# EAGLE design vr09 (EAGLE 9.5.1)
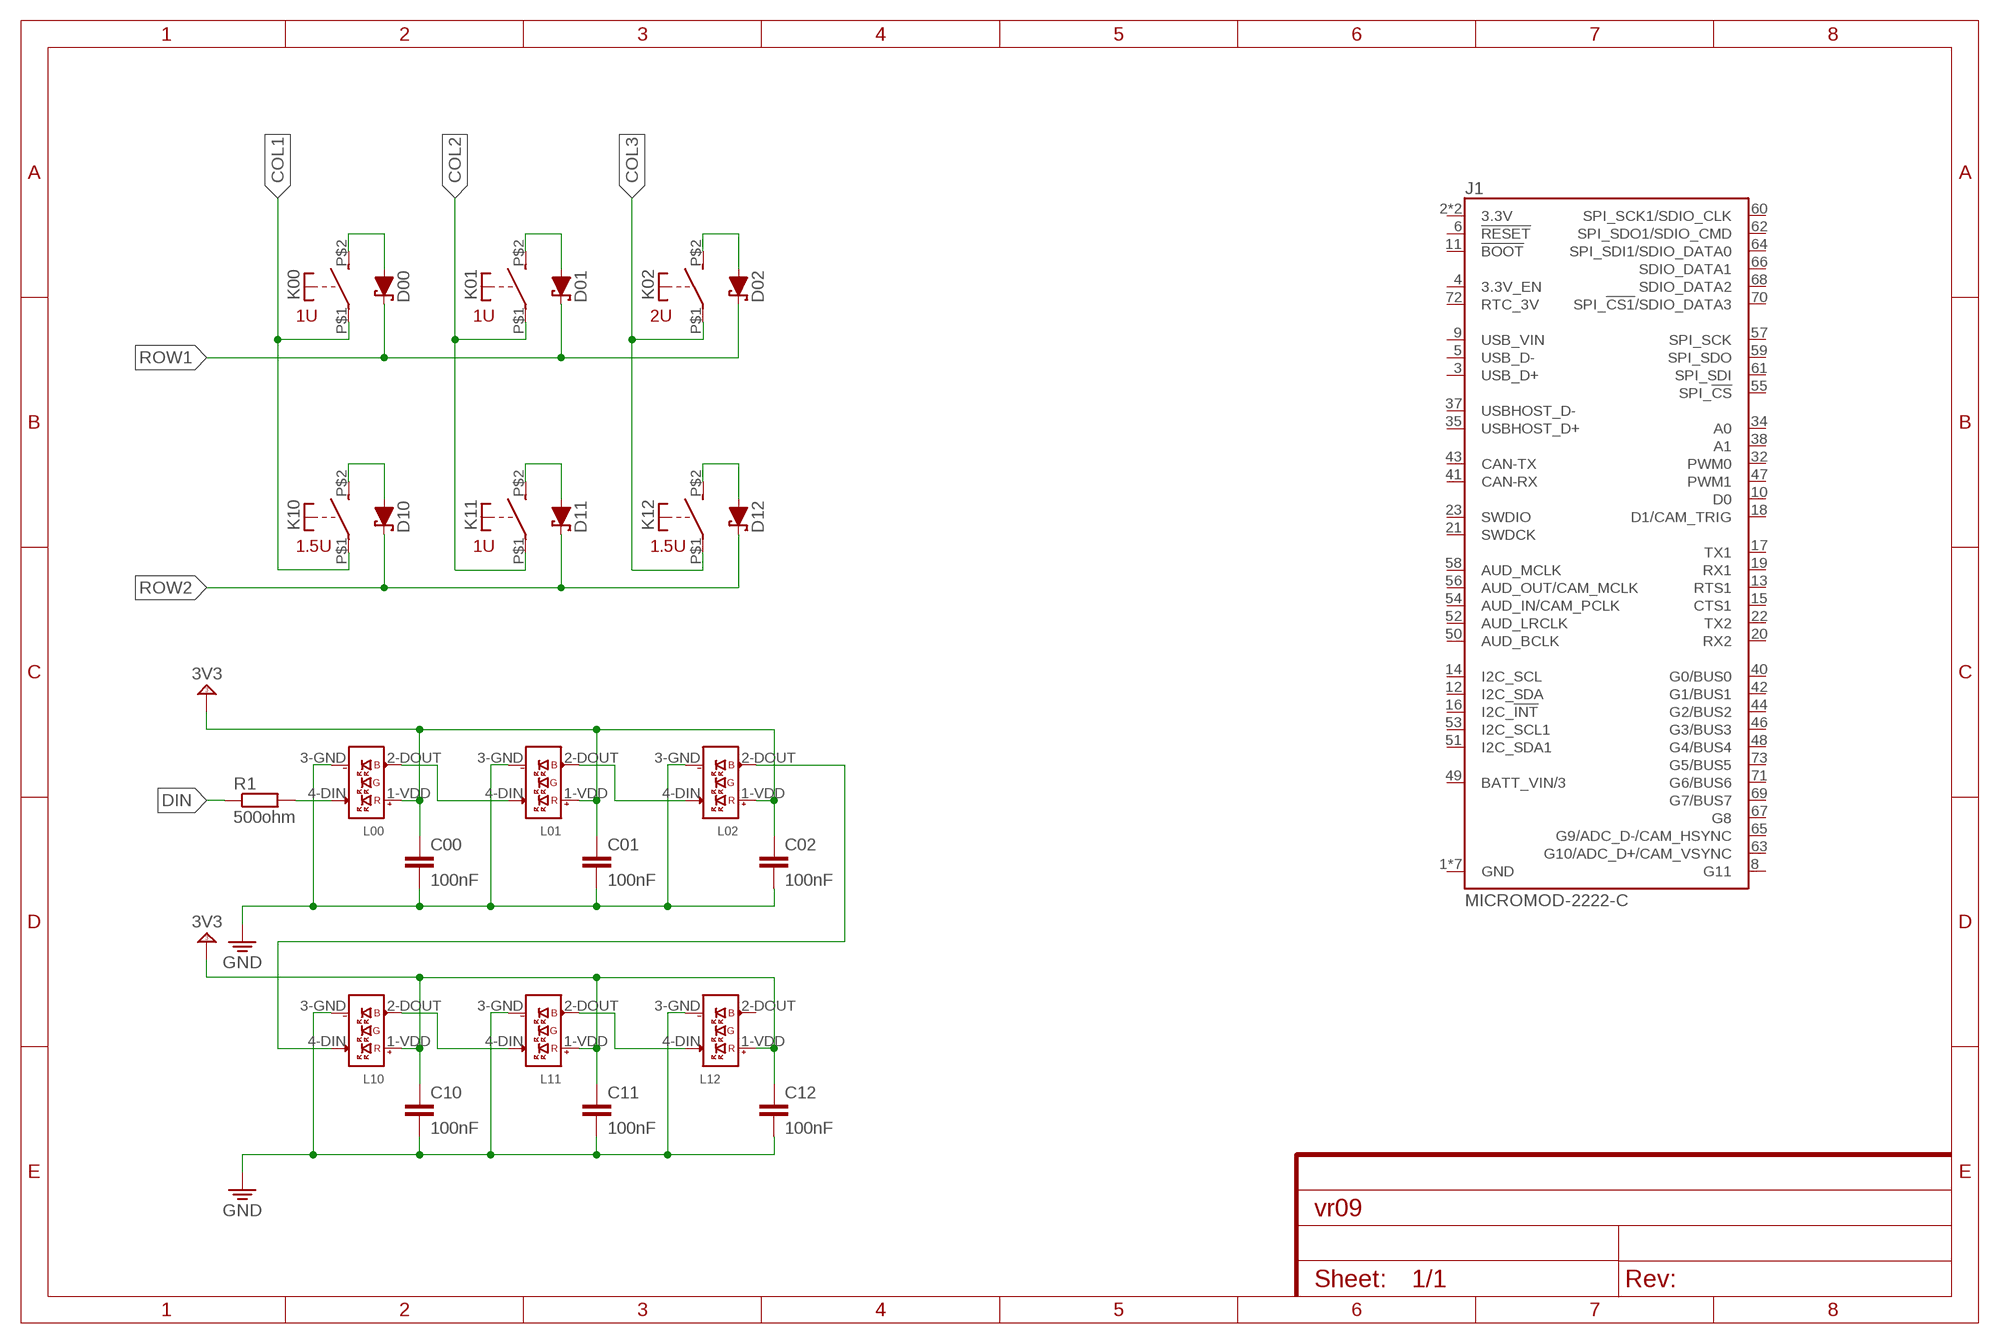
[diagram p0: schematic, sheet 1]

## Parts
C00  100nF  C-EUC0603  [C0603]
C01  100nF  C-EUC0603  [C0603]
C02  100nF  C-EUC0603  [C0603]
C10  100nF  C-EUC0603  [C0603]
C11  100nF  C-EUC0603  [C0603]
C12  100nF  C-EUC0603  [C0603]
D00  1N5819WS  [SOD-123]
D01  1N5819WS  [SOD-123]
D02  1N5819WS  [SOD-123]
D10  1N5819WS  [SOD-123]
D11  1N5819WS  [SOD-123]
D12  1N5819WS  [SOD-123]
J1  MICROMOD-2222-C  [M.2-CONNECTOR-E]
K00  MX-5-PIN-HOTSWAP  [MX-5-PIN-HOTSWAP]
K01  MX-5-PIN-HOTSWAP  [MX-5-PIN-HOTSWAP]
K02  MX-5-PIN-HOTSWAP  [MX-5-PIN-HOTSWAP]
K10  MX-5-PIN-HOTSWAP  [MX-5-PIN-HOTSWAP]
K11  MX-5-PIN-HOTSWAP  [MX-5-PIN-HOTSWAP]
K12  MX-5-PIN-HOTSWAP  [MX-5-PIN-HOTSWAP]
L00  SK6812-E-REVERSEDRILL  [SK6812-E-DRILL]
L01  SK6812-E-REVERSEDRILL  [SK6812-E-DRILL]
L02  SK6812-E-REVERSEDRILL  [SK6812-E-DRILL]
L10  SK6812-E-REVERSEDRILL  [SK6812-E-DRILL]
L11  SK6812-E-REVERSEDRILL  [SK6812-E-DRILL]
L12  SK6812-E-REVERSEDRILL  [SK6812-E-DRILL]
R1  500ohm  R-EU_R0603  [R0603]
U$1  MX-FPRINT-1905-100U  [MX-FPRINT-1905-100U]
U$2  MX-FPRINT-1905-100U  [MX-FPRINT-1905-100U]
U$3  MX-FPRINT-1905-200U  [MX-FPRINT-1905-200U]
U$4  MX-FPRINT-1905-150U  [MX-FPRINT-1905-150U]
U$5  MX-FPRINT-1905-100U  [MX-FPRINT-1905-100U]
U$6  MX-FPRINT-1905-150U  [MX-FPRINT-1905-150U]

## Nets
COL1: K00.P$1(P) K10.P$1(P)
COL2: K01.P$1(P) K11.P$1(P)
COL3: K02.P$1(P) K12.P$1(P)
DIN: R1.1
GND: C00.2 C01.2 C02.2 C10.2 C11.2 C12.2 L00.3-GND(3_GND) L01.3-GND(3_GND) L02.3-GND(3_GND) L10.3-GND(3_GND) L11.3-GND(3_GND) L12.3-GND(3_GND)
N$1: D10.A K10.P$2(S)
N$2: D11.A K11.P$2(S)
N$3: D12.A K12.P$2(S)
N$4: D02.A K02.P$2(S)
N$5: D01.A K01.P$2(S)
N$6: L00.4-DIN(4_DIN) R1.2
N$7: D00.A K00.P$2(S)
N$11: L00.2-DOUT(2_DOUT) L01.4-DIN(4_DIN)
N$12: L01.2-DOUT(2_DOUT) L02.4-DIN(4_DIN)
N$13: L11.2-DOUT(2_DOUT) L12.4-DIN(4_DIN)
N$14: L10.2-DOUT(2_DOUT) L11.4-DIN(4_DIN)
N$19: L02.2-DOUT(2_DOUT) L10.4-DIN(4_DIN)
ROW1: D00.C D01.C D02.C
ROW2: D10.C D11.C D12.C
VCC: C00.1 C01.1 C02.1 C10.1 C11.1 C12.1 L00.1-VDD(1_VDD) L01.1-VDD(1_VDD) L02.1-VDD(1_VDD) L10.1-VDD(1_VDD) L11.1-VDD(1_VDD) L12.1-VDD(1_VDD) ; supply symbol labelled 3V3
Unconnected: J1.1(GND) J1.2(3.3V) J1.3(USB_D+) J1.4(3.3V_EN) J1.5(USB_D-) J1.6(!RESET!) J1.7(GND) J1.8(G11) J1.9(USB_VIN) J1.10(D0) J1.11(!BOOT!) J1.12(I2C_SDA) J1.13(RTS1) J1.14(I2C_SCL) J1.15(CTS1) J1.16(I2C_!INT!) J1.17(TX1) J1.18(D1/CAM_TRIG) J1.19(RX1) J1.20(RX2) J1.21(SWDCK) J1.22(TX2) J1.23(SWDIO) J1.32(PWM0) J1.33(GND) J1.34(A0) J1.35(USBHOST_D+) J1.36(GND) J1.37(USBHOST_D-) J1.38(A1) J1.39(GND) J1.40(G0/BUS0) J1.41(CAN-RX) J1.42(G1/BUS1) J1.43(CAN-TX) J1.44(G2/BUS2) J1.45(GND) J1.46(G3/BUS3) J1.47(PWM1) J1.48(G4/BUS4) J1.49(BATT_VIN/3) J1.50(AUD_BCLK) J1.51(I2C_SDA1) J1.52(AUD_LRCLK) J1.53(I2C_SCL1) J1.54(AUD_IN/CAM_PCLK) J1.55(SPI_!CS!) J1.56(AUD_OUT/CAM_MCLK) J1.57(SPI_SCK) J1.58(AUD_MCLK) J1.59(SPI_SDO) J1.60(SPI_SCK1/SDIO_CLK) J1.61(SPI_SDI) J1.62(SPI_SDO1/SDIO_CMD) J1.63(G10/ADC_D+/CAM_VSYNC) J1.64(SPI_SDI1/SDIO_DATA0) J1.65(G9/ADC_D-/CAM_HSYNC) J1.66(SDIO_DATA1) J1.67(G8) J1.68(SDIO_DATA2) J1.69(G7/BUS7) J1.70(SPI_!CS1!/SDIO_DATA3) J1.71(G6/BUS6) J1.72(RTC_3V) J1.73(G5/BUS5) J1.74(3.3V) J1.75(GND) L12.2-DOUT(2_DOUT)

## Library data of the parts
C00 C01 C02 C10-C12 = rcl:C-EU: CAPACITOR, European symbol; SPICEPREFIX: C
D00 D01 D02 D10-D12 = jlcpcb_basic_parts:1N5819WS: JLCPCB Part # C8598 Description 40V 600mV@1A 1A SOD-123 Schottky Barrier Diodes (SBD) ROHS Schottky Diode
J1 = SparkFun-MicroMod:MICROMOD: MicroMod Connector Description: A card edge connector and mating PCB connector to allow various MicroMod Processor Boards to be coupled with various carrier boards of different capabilities. Based on the M.2 standard.; PROD_ID: CONN-14877
K00 K01 K02 K10-K12 = ts_keyboards:MX-5-PIN-HOTSWAP
L00 L01 L02 L10-L12 = ts_keyboards:SK6812-E-REVERSE
R1 = rcl:R-EU_: RESISTOR, European symbol; SPICEPREFIX: R
U$1 U$2 U$5 = ts_keyboards:MX-FPRINT-1905-100U
U$3 = ts_keyboards:MX-FPRINT-1905-200U
U$4 U$6 = ts_keyboards:MX-FPRINT-1905-150U

## Board
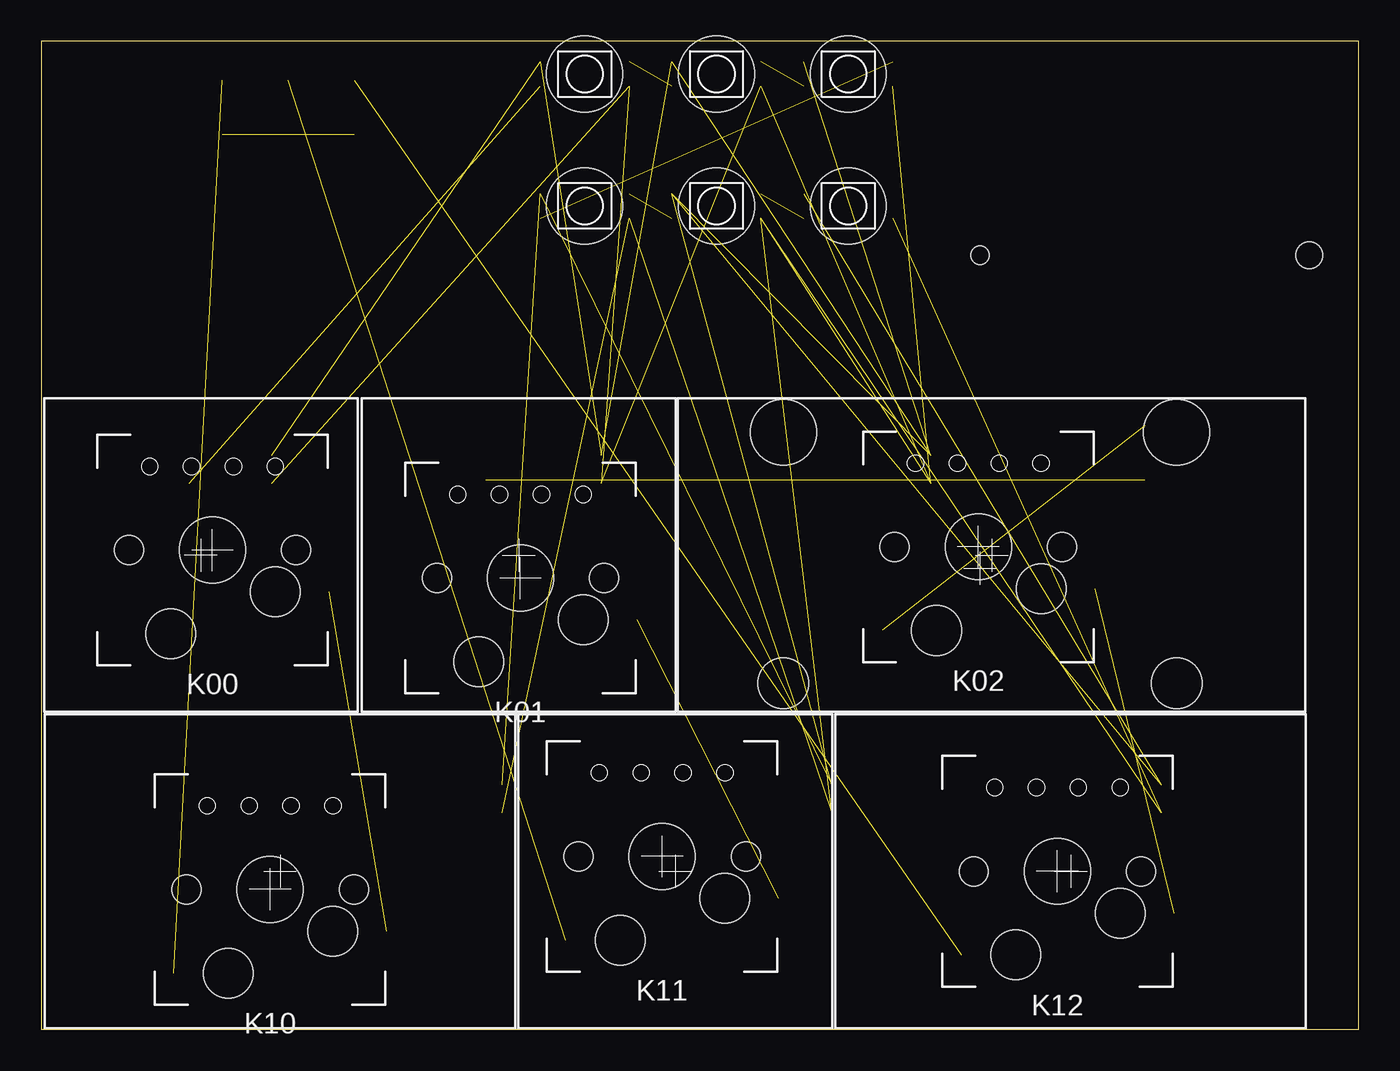
[diagram p1: board, top side]
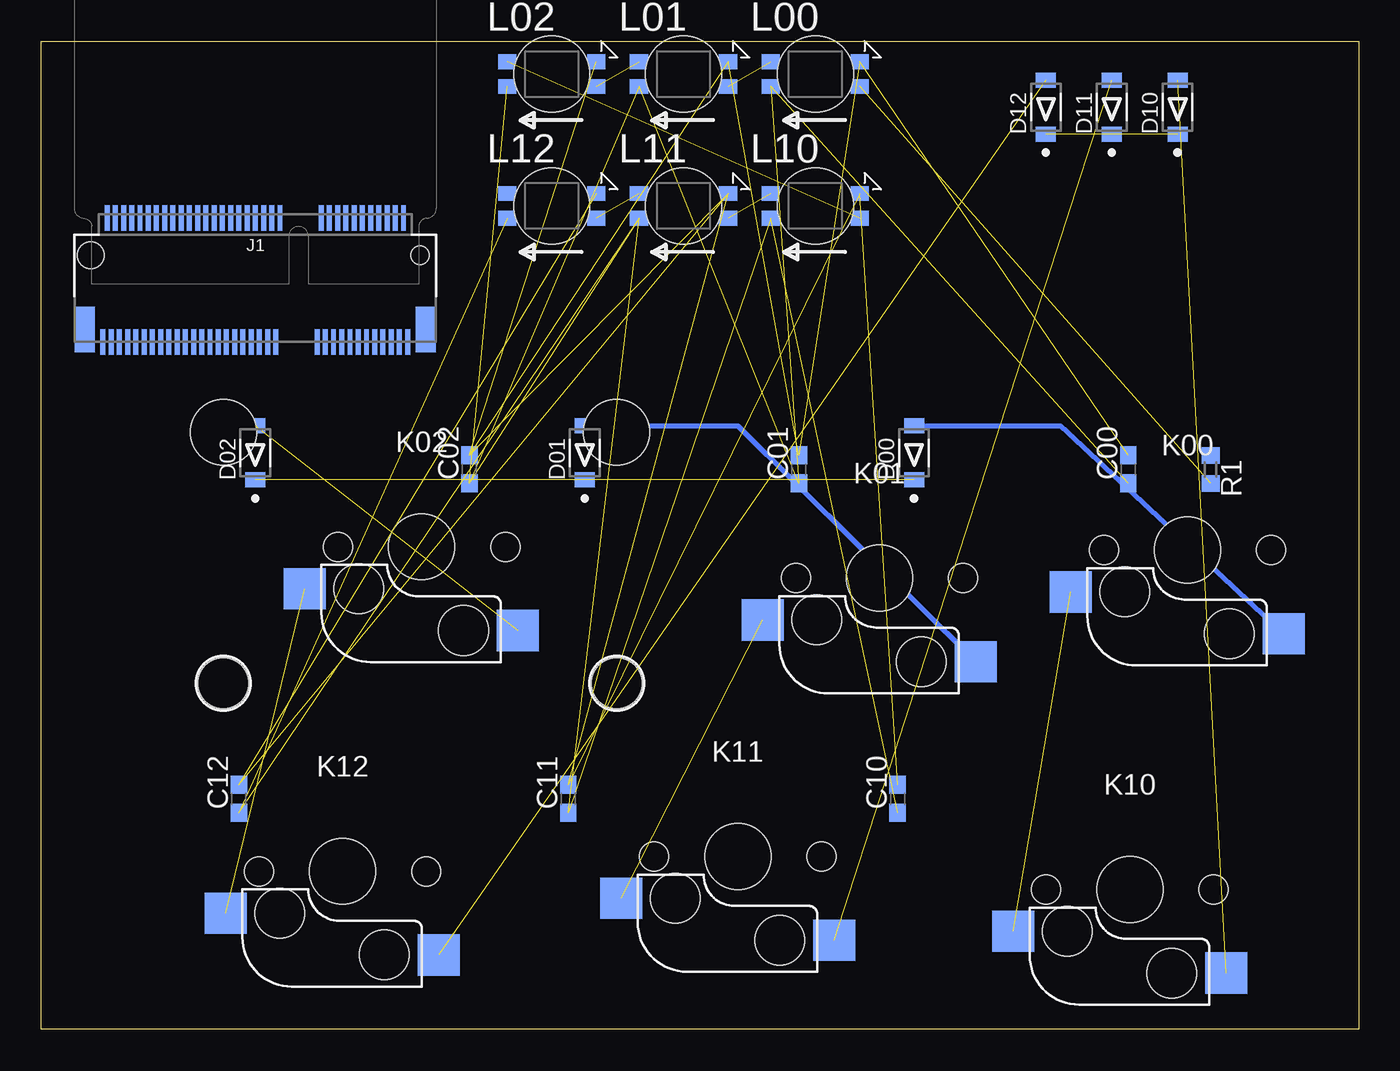
[diagram p2: board, bottom side, seen from below]

Size 80 x 60 mm. Coordinates in mm from the lower left corner, seen from the top.
Outline: 0,0 80,0 80,60 0,60 0,0
Copper layers (1*16): Top 0.035mm / dielectric 1.5mm / Bottom 0.035mm
Design rules "default": minimum track width 6mil, minimum drill 0.35mm, track to track 6mil, track to pad 6mil, pad to pad 6mil, via to via 6mil, smd to smd 6mil, copper to edge 40mil, drill to drill 6mil, minimum pad ring 10mil, minimum via ring 8mil, stop-mask expansion 4mil, vias tented up to drill 0mil, thermal gap 10mil

### Footprints (pad centres in the part's own frame; a part is rotated, then mirrored left to right if it is on the bottom)
C0603 = smd 1.1 x 1: 1 -0.85,0; 2 0.85,0
SOD-123 = smd 0.914 x 1.219: A 1.638,0; C -1.638,0
M.2-CONNECTOR-E = smd 0.3 x 1.55: 1 9.25,-5.275; 2 9,2.275; 3 8.75,-5.275; 4 8.5,2.275; 5 8.25,-5.275; 6 8,2.275; 7 7.75,-5.275; 8 7.5,2.275; 9 7.25,-5.275; 10 7,2.275; 11 6.75,-5.275; 12 6.5,2.275; 13 6.25,-5.275; 14 6,2.275; 15 5.75,-5.275; 16 5.5,2.275; 17 5.25,-5.275; 18 5,2.275; 19 4.75,-5.275; 20 4.5,2.275; 21 4.25,-5.275; 22 4,2.275; 23 3.75,-5.275; 32 1.5,2.275; 33 1.25,-5.275; 34 1,2.275; 35 0.75,-5.275; 36 0.5,2.275; 37 0.25,-5.275; 38 0,2.275; 39 -0.25,-5.275; 40 -0.5,2.275; 41 -0.75,-5.275; 42 -1,2.275; 43 -1.25,-5.275; 44 -1.5,2.275; 45 -1.75,-5.275; 46 -2,2.275; 47 -2.25,-5.275; 48 -2.5,2.275; 49 -2.75,-5.275; 50 -3,2.275; 51 -3.25,-5.275; 52 -3.5,2.275; 53 -3.75,-5.275; 54 -4,2.275; 55 -4.25,-5.275; 56 -4.5,2.275; 57 -4.75,-5.275; 58 -5,2.275; 59 -5.25,-5.275; 60 -5.5,2.275; 61 -5.75,-5.275; 62 -6,2.275; 63 -6.25,-5.275; 64 -6.5,2.275; 65 -6.75,-5.275; 66 -7,2.275; 67 -7.25,-5.275; 68 -7.5,2.275; 69 -7.75,-5.275; 70 -8,2.275; 71 -8.25,-5.275; 72 -8.5,2.275; 73 -8.75,-5.275; 74 -9,2.275; 75 -9.25,-5.275 | smd 1.2 x 2.75: A1 10.35,-4.5; A2 -10.35,-4.5 | hole 1.1: 10,0 | hole 1.6: -10,0
MX-5-PIN-HOTSWAP = smd 2.55 x 2.5 bottom: P$1 -7.085,2.54; P$2 5.842,5.08 | hole 3.988: 0,0 | hole 1.75: -5.08,0; 5.08,0 | hole 3: 2.54,5.08; -3.81,2.54
SK6812-E-DRILL = smd 1.1 x 0.9 bottom: 1-VDD 2.7,-0.749; 2-DOUT 2.7,0.751; 3-GND -2.7,0.751; 4-DIN -2.7,-0.749 | hole 4.6: 0,0
R0603 = smd 1 x 1.1: 1 -0.85,0; 2 0.85,0
MX-STABS-200U = hole 3.988: -11.938,8.255; 11.938,8.255 | hole 3.048: -11.938,-6.985; 11.938,-6.985

### Placement (x,y rotation side)
C00  14,34 90 bottom
C01  34,34 90 bottom
C02  54,34 90 bottom
C10  28,14 90 bottom
C11  48,14 90 bottom
C12  68,14 90 bottom
D00  27,35 90 bottom
D01  47,35 90 bottom
D02  67,35 90 bottom
D10  11,56 90 bottom
D11  15,56 90 bottom
D12  19,56 90 bottom
J1  67,47 0 bottom
K00  10.4,29.1 180 top
K01  29.1,27.4 180 top
K02  56.9,29.3 180 top
K10  13.9,8.5 180 top
K11  37.7,10.5 180 top
K12  61.7,9.6 180 top
L00  33,58 0 top
L01  41,58 0 top
L02  49,58 0 top
L10  33,50 0 top
L11  41,50 0 top
L12  49,50 0 top
R1  9,34 270 bottom
U$1  9.7,28.8 270 top
U$2  29,28.8 0 top
U$3  57.7,28.8 0 top
U$4  14.5,9.6 0 top
U$5  38.5,9.6 0 top
U$6  62.5,9.6 0 top
U$7  [MX-STABS-200U]  57,28 0 top

### Tracks (layer width: path | path; a pad name or v marks a point on that pad's centre or on a via)
COL1  (1 unrouted)
COL2  (1 unrouted)
COL3  (1 unrouted)
GND  (11 unrouted)
N$1  (1 unrouted)
N$2  (1 unrouted)
N$3  (1 unrouted)
N$4  (1 unrouted)
N$5
  Bottom 0.305: D01.A 37.7,36.64 K01.P$2
N$6  (1 unrouted)
N$7
  Bottom 0.305: D00.A 18.1,36.64 K00.P$2
N$11  (1 unrouted)
N$12  (1 unrouted)
N$13  (1 unrouted)
N$14  (1 unrouted)
N$19  (1 unrouted)
ROW1  (2 unrouted)
ROW2  (2 unrouted)
VCC  (11 unrouted)